# EAGLE schematic 32 bit buffered shift register (EAGLE 6.5.0)
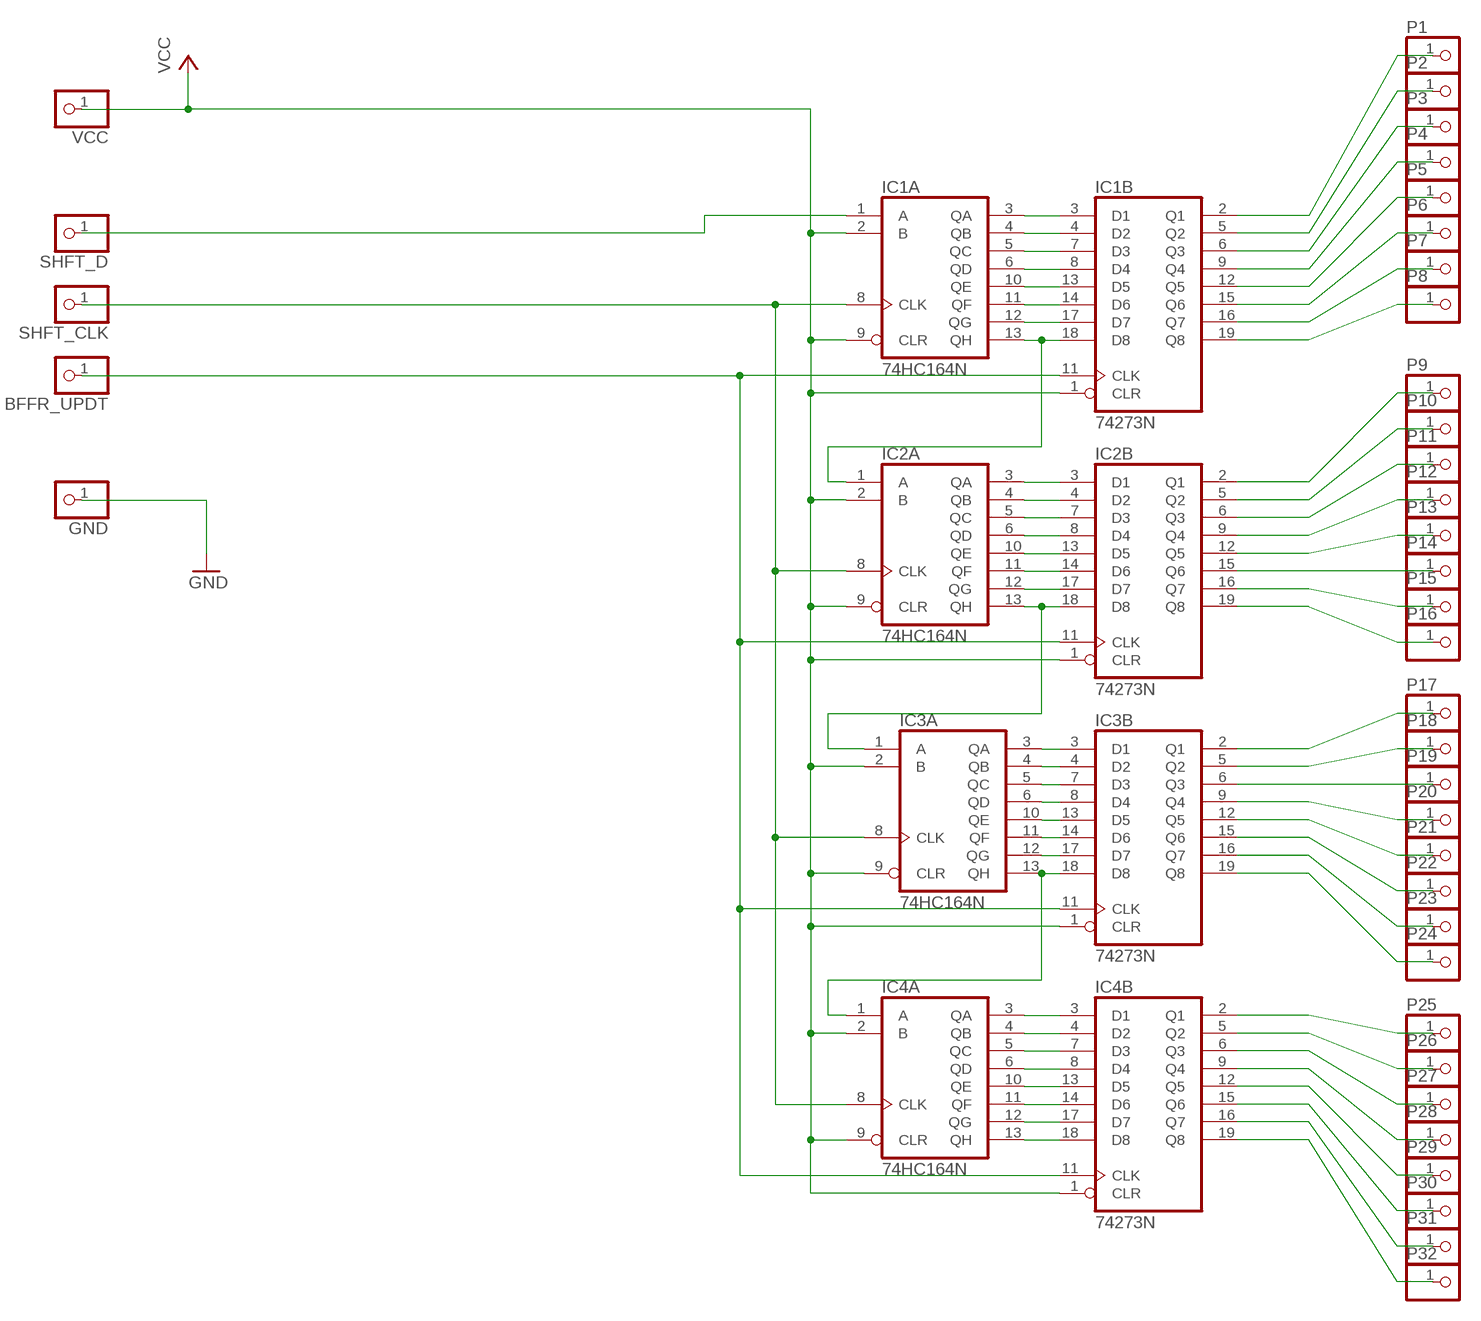
[diagram p0: schematic, sheet 1]

## Parts
BFFR_UPDT  PINHD-1X1  [1X01]
GND  PINHD-1X1  [1X01]
IC1A  74HC164N  [DIL14]
IC1B  74273N  [DIL20]
IC2A  74HC164N  [DIL14]
IC2B  74273N  [DIL20]
IC3A  74HC164N  [DIL14]
IC3B  74273N  [DIL20]
IC4A  74HC164N  [DIL14]
IC4B  74273N  [DIL20]
P1  PINHD-1X1  [1X01]
P2  PINHD-1X1  [1X01]
P3  PINHD-1X1  [1X01]
P4  PINHD-1X1  [1X01]
P5  PINHD-1X1  [1X01]
P6  PINHD-1X1  [1X01]
P7  PINHD-1X1  [1X01]
P8  PINHD-1X1  [1X01]
P9  PINHD-1X1  [1X01]
P10  PINHD-1X1  [1X01]
P11  PINHD-1X1  [1X01]
P12  PINHD-1X1  [1X01]
P13  PINHD-1X1  [1X01]
P14  PINHD-1X1  [1X01]
P15  PINHD-1X1  [1X01]
P16  PINHD-1X1  [1X01]
P17  PINHD-1X1  [1X01]
P18  PINHD-1X1  [1X01]
P19  PINHD-1X1  [1X01]
P20  PINHD-1X1  [1X01]
P21  PINHD-1X1  [1X01]
P22  PINHD-1X1  [1X01]
P23  PINHD-1X1  [1X01]
P24  PINHD-1X1  [1X01]
P25  PINHD-1X1  [1X01]
P26  PINHD-1X1  [1X01]
P27  PINHD-1X1  [1X01]
P28  PINHD-1X1  [1X01]
P29  PINHD-1X1  [1X01]
P30  PINHD-1X1  [1X01]
P31  PINHD-1X1  [1X01]
P32  PINHD-1X1  [1X01]
SHFT_CLK  PINHD-1X1  [1X01]
SHFT_D  PINHD-1X1  [1X01]
VCC  PINHD-1X1  [1X01]

## Nets
GND: GND.1
N$1: IC1B.2(Q1) P1.1
N$2: IC1B.5(Q2) P2.1
N$3: IC1B.6(Q3) P3.1
N$4: IC1B.9(Q4) P4.1
N$5: IC1B.12(Q5) P5.1
N$6: IC1B.15(Q6) P6.1
N$7: IC1B.16(Q7) P7.1
N$8: IC1B.19(Q8) P8.1
N$9: IC2B.2(Q1) P9.1
N$10: IC2B.5(Q2) P10.1
N$11: IC2B.6(Q3) P11.1
N$12: IC2B.9(Q4) P12.1
N$13: IC2B.12(Q5) P13.1
N$14: IC2B.15(Q6) P14.1
N$15: IC2B.16(Q7) P15.1
N$16: IC2B.19(Q8) P16.1
N$17: IC3B.2(Q1) P17.1
N$18: IC3B.5(Q2) P18.1
N$19: IC3B.6(Q3) P19.1
N$20: IC3B.9(Q4) P20.1
N$21: IC3B.12(Q5) P21.1
N$22: IC3B.15(Q6) P22.1
N$23: IC3B.16(Q7) P23.1
N$24: IC3B.19(Q8) P24.1
N$25: IC4B.2(Q1) P25.1
N$26: IC4B.5(Q2) P26.1
N$27: IC4B.6(Q3) P27.1
N$28: IC4B.9(Q4) P28.1
N$29: IC4B.12(Q5) P29.1
N$30: IC4B.15(Q6) P30.1
N$31: IC4B.16(Q7) P31.1
N$32: IC4B.19(Q8) P32.1
N$33: IC1A.3(QA) IC1B.3(D1)
N$34: IC1A.4(QB) IC1B.4(D2)
N$35: IC1A.5(QC) IC1B.7(D3)
N$36: IC1A.6(QD) IC1B.8(D4)
N$37: IC1A.10(QE) IC1B.13(D5)
N$38: IC1A.11(QF) IC1B.14(D6)
N$39: IC1A.12(QG) IC1B.17(D7)
N$40: IC1A.13(QH) IC1B.18(D8) IC2A.1(A)
N$41: IC2A.3(QA) IC2B.3(D1)
N$42: IC2A.4(QB) IC2B.4(D2)
N$43: IC2A.5(QC) IC2B.7(D3)
N$44: IC2A.6(QD) IC2B.8(D4)
N$45: IC2A.10(QE) IC2B.13(D5)
N$46: IC2A.11(QF) IC2B.14(D6)
N$48: IC2A.13(QH) IC2B.18(D8) IC3A.1(A)
N$49: IC3A.3(QA) IC3B.3(D1)
N$50: IC3A.4(QB) IC3B.4(D2)
N$51: IC3A.5(QC) IC3B.7(D3)
N$52: IC3A.6(QD) IC3B.8(D4)
N$53: IC3A.10(QE) IC3B.13(D5)
N$54: IC3A.11(QF) IC3B.14(D6)
N$55: IC3A.12(QG) IC3B.17(D7)
N$56: IC3A.13(QH) IC3B.18(D8) IC4A.1(A)
N$57: IC4A.3(QA) IC4B.3(D1)
N$58: IC4A.4(QB) IC4B.4(D2)
N$59: IC4A.5(QC) IC4B.7(D3)
N$60: IC4A.6(QD) IC4B.8(D4)
N$61: IC4A.10(QE) IC4B.13(D5)
N$62: IC4A.11(QF) IC4B.14(D6)
N$63: IC4A.12(QG) IC4B.17(D7)
N$64: IC4A.13(QH) IC4B.18(D8)
N$70: BFFR_UPDT.1 IC1B.11(CLK) IC2B.11(CLK) IC3B.11(CLK) IC4B.11(CLK)
N$71: IC1A.1(A) SHFT_D.1
N$76: IC1A.8(CLK) IC2A.8(CLK) IC3A.8(CLK) IC4A.8(CLK) SHFT_CLK.1
N$85: IC2A.12(QG) IC2B.17(D7)
VCC: IC1A.2(B) IC1A.9(CLR) IC1B.1(CLR) IC2A.2(B) IC2A.9(CLR) IC2B.1(CLR) IC3A.2(B) IC3A.9(CLR) IC3B.1(CLR) IC4A.2(B) IC4A.9(CLR) IC4B.1(CLR) VCC.1

## Power pins joined to a net without a drawn wire
GND: IC1A.7(GND) IC1B.10(GND) IC2A.7(GND) IC2B.10(GND) IC3A.7(GND) IC3B.10(GND) IC4A.7(GND) IC4B.10(GND)
VCC: IC1A.14(VCC) IC1B.20(VCC) IC2A.14(VCC) IC2B.20(VCC) IC3A.14(VCC) IC3B.20(VCC) IC4A.14(VCC) IC4B.20(VCC)

## Library data of the parts
BFFR_UPDT GND P1-P32 SHFT_CLK SHFT_D VCC = pinhead:PINHD-1X1: PIN HEADER
IC1A IC2A IC3A IC4A = 74xx-us:74*164: 8-bit parallel out SHIFT REGISTER
IC1B IC2B IC3B IC4B = 74xx-us:74*273: Octal D type FLIP FLOP, clear